# Altium schematic sheet universky.SchDoc
size A4
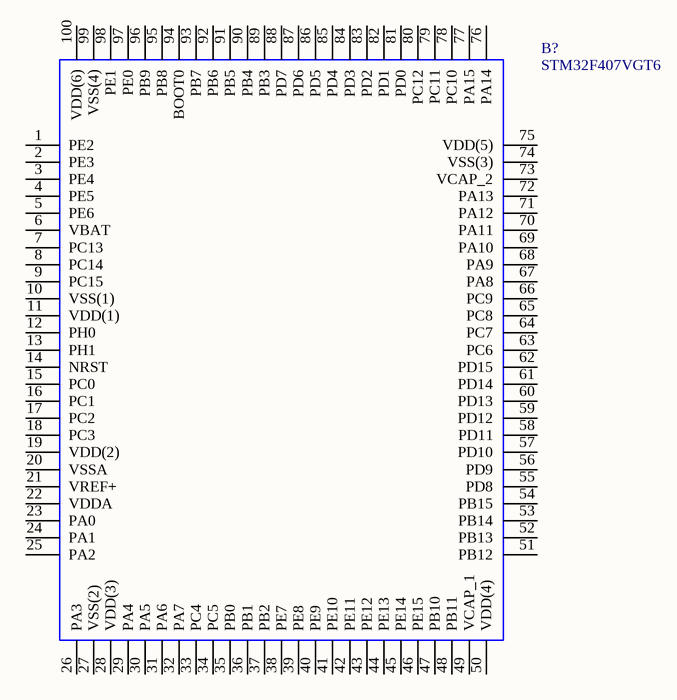
[diagram p0: universky.SchDoc]

## Parts
B?  STM32F407VGT6  [QFP50P1600X1600X160-100N]

## Nets

Not connected (* = marked no-connect by the designer): B? 1(PE2) 2(PE3) 3(PE4) 4(PE5) 5(PE6) 6(VBAT) 7(PC13) 8(PC14) 9(PC15) 10(VSS(1)) 11(VDD(1)) 12(PH0) 13(PH1) 14(NRST) 15(PC0) 16(PC1) 17(PC2) 18(PC3) 19(VDD(2)) 20(VSSA) 21(VREF+) 22(VDDA) 23(PA0) 24(PA1) 25(PA2) 26(PA3) 27(VSS(2)) 28(VDD(3)) 29(PA4) 30(PA5) 31(PA6) 32(PA7) 33(PC4) 34(PC5) 35(PB0) 36(PB1) 37(PB2) 38(PE7) 39(PE8) 40(PE9) 41(PE10) 42(PE11) 43(PE12) 44(PE13) 45(PE14) 46(PE15) 47(PB10) 48(PB11) 49(VCAP_1) 50(VDD(4)) 51(PB12) 52(PB13) 53(PB14) 54(PB15) 55(PD8) 56(PD9) 57(PD10) 58(PD11) 59(PD12) 60(PD13) 61(PD14) 62(PD15) 63(PC6) 64(PC7) 65(PC8) 66(PC9) 67(PA8) 68(PA9) 69(PA10) 70(PA11) 71(PA12) 72(PA13) 73(VCAP_2) 74(VSS(3)) 75(VDD(5)) 76(PA14) 77(PA15) 78(PC10) 79(PC11) 80(PC12) 81(PD0) 82(PD1) 83(PD2) 84(PD3) 85(PD4) 86(PD5) 87(PD6) 88(PD7) 89(PB3) 90(PB4) 91(PB5) 92(PB6) 93(PB7) 94(BOOT0) 95(PB8) 96(PB9) 97(PE0) 98(PE1) 99(VSS(4)) 100(VDD(6))

## Library data of the parts
B? = STM32F407VGT6: MCU 32-Bit, ARM Cortex M4, 1MB Flash STMicroelectronics STM32F407VGT6, 32bit ARM Cortex M4F Microcontroller, 168MHz, 1024 kB Flash, 100-Pin LQFP; Allied_Number: 70391107; Geometry.Height: 1.6mm; Supplier_Name: RS; RS Part Number: 7468226; Manufacturer_Name: STMicroelectronics; Manufacturer_Part_Number: STM32F407VGT6; Other Part Number: *; Datasheet Link: http://www.st.com/web/en/resource/technical/document/datasheet/DM00037051.pdf; 3D Package: *